# Altium schematic sheet DriverControls_CarrierBoardMezzanine.SchDoc: Mezzanine Pinout
size Letter; Author: Norman Chong; Revision: 1.23; SheetNumber: 1; SheetTotal: 2; Website: www.uwmidsun.com; ProjectName: Driver Controls
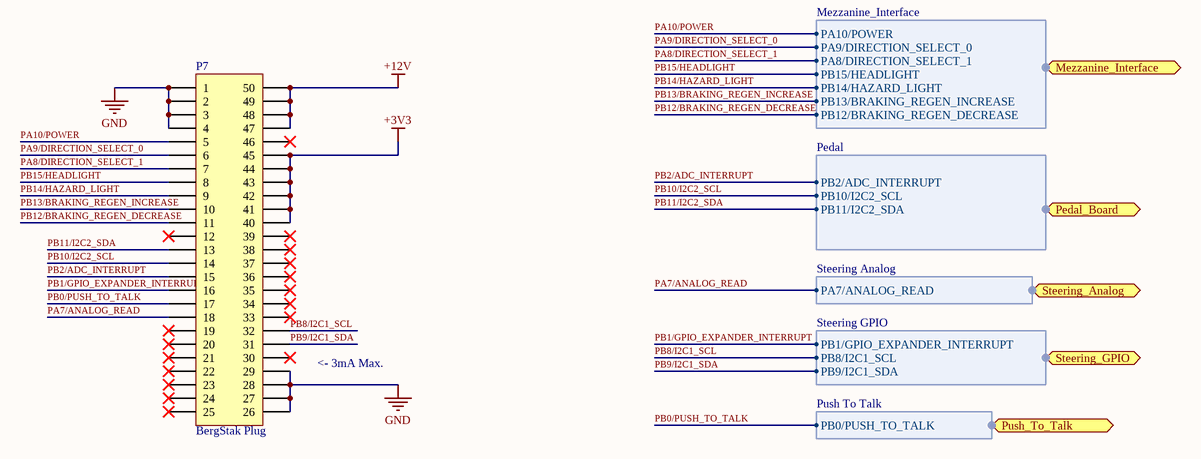
[diagram p0: DriverControls_CarrierBoardMezzanine.SchDoc]

## Parts
P7  Series: BergStak Plug  [CONN, Bergstak 50 Pos Plug]  (hidden comment: CONN 50POS Bergstak Plug 0.02")

## Ports
Mezzanine_Interface (harness Mezzanine_Interface), Pedal_Board (harness Pedal), Push_To_Talk (harness Push To Talk), Steering_Analog (harness Steering Analog), Steering_GPIO (harness Steering GPIO)

## Harnesses
Mezzanine_Interface: PA10/POWER, PA9/DIRECTION_SELECT_0, PA8/DIRECTION_SELECT_1, PB15/HEADLIGHT, PB14/HAZARD_LIGHT, PB13/BRAKING_REGEN_INCREASE, PB12/BRAKING_REGEN_DECREASE
Pedal: PB10/I2C2_SCL, PB2/ADC_INTERRUPT, PB11/I2C2_SDA
Steering Analog: PA7/ANALOG_READ
Steering GPIO: PB8/I2C1_SCL, PB9/I2C1_SDA, PB1/GPIO_EXPANDER_INTERRUPT
Push To Talk: PB0/PUSH_TO_TALK

## Nets
+3V3: P7.40 P7.41 P7.42 P7.43 P7.44 P7.45
+12V: P7.47 P7.48 P7.49 P7.50
GND: P7.1 P7.2 P7.3 P7.4 P7.26 P7.27 P7.28 P7.29
PA7/ANALOG_READ: P7.18 ; port Steering_Analog.PA7/ANALOG_READ
PA8/DIRECTION_SELECT_1: P7.7 ; port Mezzanine_Interface.PA8/DIRECTION_SELECT_1
PA9/DIRECTION_SELECT_0: P7.6 ; port Mezzanine_Interface.PA9/DIRECTION_SELECT_0
PA10/POWER: P7.5 ; port Mezzanine_Interface.PA10/POWER
PB0/PUSH_TO_TALK: P7.17 ; port Push_To_Talk.PB0/PUSH_TO_TALK
PB1/GPIO_EXPANDER_INTERRUPT: P7.16 ; port Steering_GPIO.PB1/GPIO_EXPANDER_INTERRUPT
PB2/ADC_INTERRUPT: P7.15 ; port Pedal_Board.PB2/ADC_INTERRUPT
PB8/I2C1_SCL: P7.32 ; port Steering_GPIO.PB8/I2C1_SCL
PB9/I2C1_SDA: P7.31 ; port Steering_GPIO.PB9/I2C1_SDA
PB10/I2C2_SCL: P7.14 ; port Pedal_Board.PB10/I2C2_SCL
PB11/I2C2_SDA: P7.13 ; port Pedal_Board.PB11/I2C2_SDA
PB12/BRAKING_REGEN_DECREASE: P7.11 ; port Mezzanine_Interface.PB12/BRAKING_REGEN_DECREASE
PB13/BRAKING_REGEN_INCREASE: P7.10 ; port Mezzanine_Interface.PB13/BRAKING_REGEN_INCREASE
PB14/HAZARD_LIGHT: P7.9 ; port Mezzanine_Interface.PB14/HAZARD_LIGHT
PB15/HEADLIGHT: P7.8 ; port Mezzanine_Interface.PB15/HEADLIGHT

Not connected (* = marked no-connect by the designer): P7 12* 19* 20* 21* 22* 23* 24* 25* 30* 33* 34* 35* 36* 37* 38* 39* 46*

## Notes on the sheet
- <- 3mA Max.
- Project:
- Title:
- Size:
- Project Lead:
- Letter
- Revision:
- University of Waterloo
- 200 University Ave W
- Waterloo, ON, Canada
- N2L 3E9
- Date:
- Sheet
- of
- Website:

## Library data of the parts
P7 = CONN 50POS Bergstak Plug 0.02": 50 Position Connector Plug, Outer Shroud Contacts Surface Mount Gold; Manufacturer 1: Amphenol FCI; Manufacturer Part Number 1: 10132797-055100LF; Number of Positions: 50; Mated Stacking Heights: 5mm; Pitch: 0.020" (0.50mm); Supplier 1: Digi-Key; Supplier Part Number 1: 609-5226-1-ND; Packaging: Cut Tape (CT); Part Status: Active; Connector Type: Plug, Outer Shroud Contacts; Number of Rows: 2; Mounting Type: Surface Mount; Contact Finish: Gold; Contact Finish Thickness: 1µin (0.025µm); Height Above Board: 0.169" (4.30mm); ComponentLink1URL: http://portal.fciconnect.com/Comergent//fci/drawing/10132797.pdf; ComponentLink1Description: http://portal.fciconnect.com/Comergent//fci/drawing/10132797.pdf